# Altium schematic sheet FPGA_Power_Mannager.SchDoc
size A4
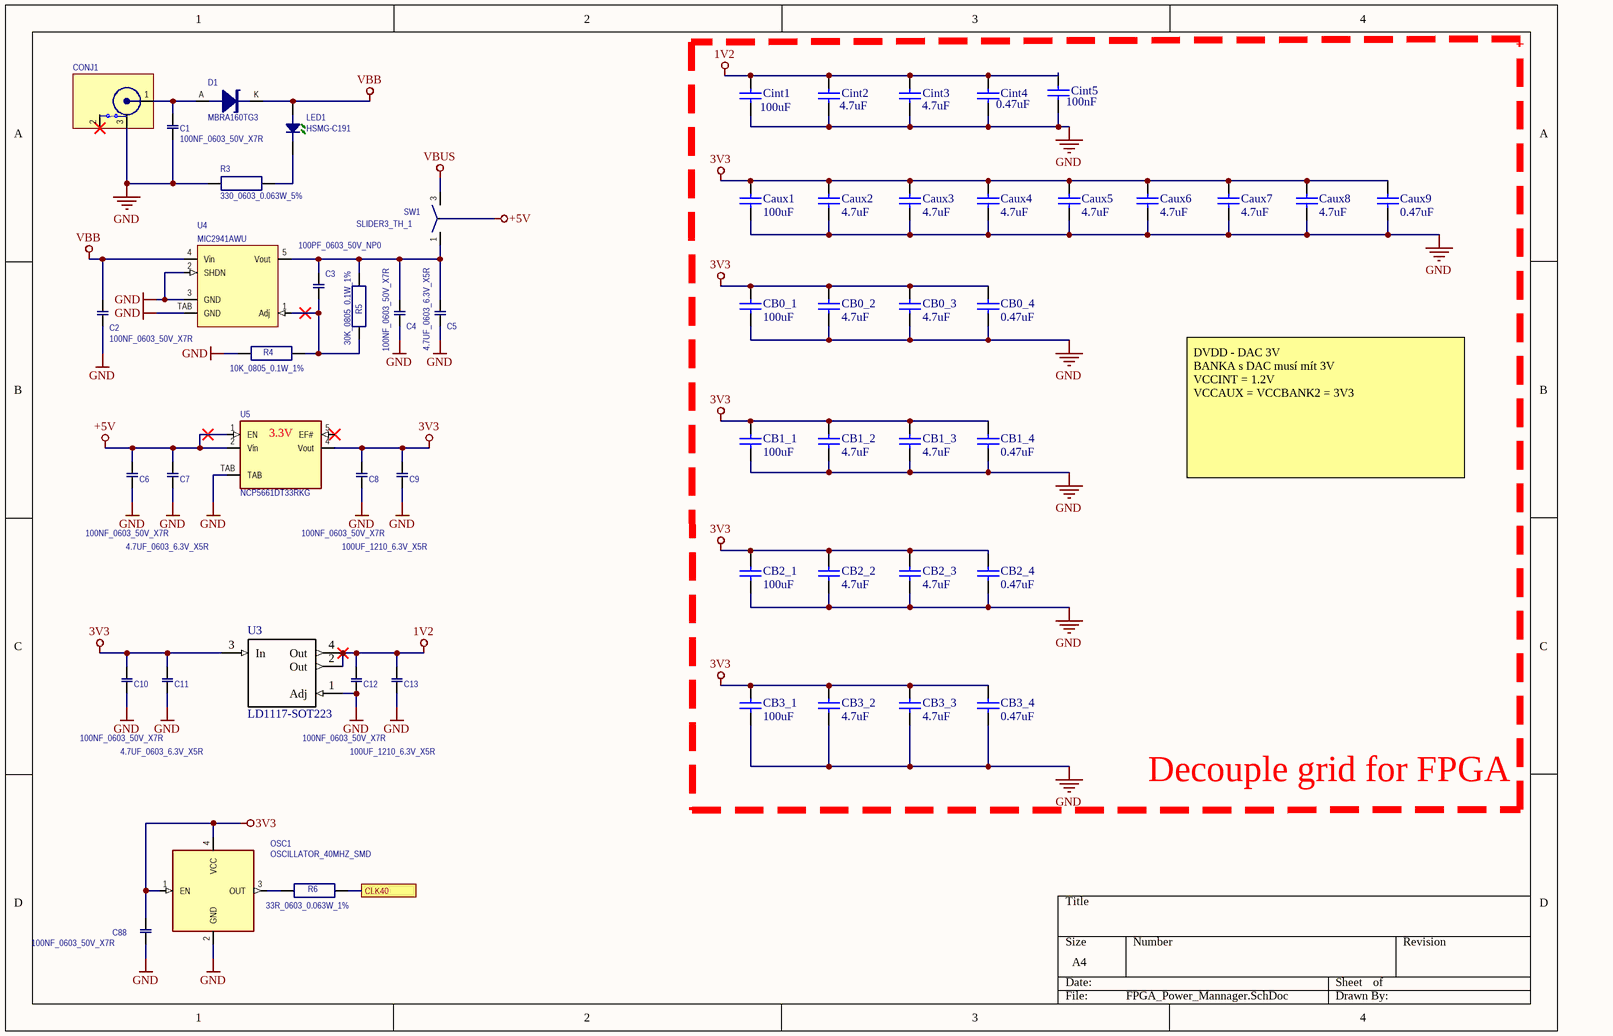
[diagram p0: FPGA_Power_Mannager.SchDoc]

## Parts
C1  100NF_0603_50V_X7R  [CAP0603]
C2  100NF_0603_50V_X7R  [CAP0603]
C3  100PF_0603_50V_NP0  [CAP0603]
C4  100NF_0603_50V_X7R  [CAP0603]
C5  4.7UF_0603_6.3V_X5R  [CAP0603]
C6  100NF_0603_50V_X7R  [CAP0603]
C7  4.7UF_0603_6.3V_X5R  [CAP0603]
C8  100NF_0603_50V_X7R  [CAP0603]
C9  100UF_1210_6.3V_X5R  [CAP1210]
C10  100NF_0603_50V_X7R  [CAP0603]
C11  4.7UF_0603_6.3V_X5R  [CAP0603]
C12  100NF_0603_50V_X7R  [CAP0603]
C13  100UF_1210_6.3V_X5R  [CAP1210]
C88  100NF_0603_50V_X7R  [CAP0603]
Caux1  100UF  [C1206]
Caux2  4.7UF  [1608[0603]]
Caux3  4.7UF  [1608[0603]]
Caux4  4.7UF  [1608[0603]]
Caux5  4.7UF  [1608[0603]]
Caux6  4.7UF  [1608[0603]]
Caux7  4.7UF  [1608[0603]]
Caux8  4.7UF  [1608[0603]]
Caux9  value 0.47uF  [1608[0603]]  (hidden comment: 470nF)
CB0_1  100UF  [C1206]
CB0_2  4.7UF  [1608[0603]]
CB0_3  4.7UF  [1608[0603]]
CB0_4  value 0.47uF  [1608[0603]]  (hidden comment: 470nF)
CB1_1  100UF  [C1206]
CB1_2  4.7UF  [1608[0603]]
CB1_3  4.7UF  [1608[0603]]
CB1_4  value 0.47uF  [1608[0603]]  (hidden comment: 470nF)
CB2_1  100UF  [C1206]
CB2_2  4.7UF  [1608[0603]]
CB2_3  4.7UF  [1608[0603]]
CB2_4  value 0.47uF  [1608[0603]]  (hidden comment: 470nF)
CB3_1  100UF  [C1206]
CB3_2  4.7UF  [1608[0603]]
CB3_3  4.7UF  [1608[0603]]
CB3_4  value 0.47uF  [1608[0603]]  (hidden comment: 470nF)
Cint1  100UF  [C1206]
Cint2  4.7UF  [1608[0603]]
Cint3  4.7UF  [1608[0603]]
Cint4  value 0.47uF  [1608[0603]]  (hidden comment: 470nF)
Cint5  100nF  [1608[0603]]
CONJ1  CON_POWER_DC10A_CLIFF  [CON_POWER_DC10A_CLIFF]  (value not drawn)
D1  MBRA160TG3  [SMA_KA]
LED1  HSMG-C191  [D0603]
OSC1  OSCILLATOR_40MHZ_SMD  [CFPS-73]
R3  330_0603_0.063W_5%  [R0603]
R4  10K_0805_0.1W_1%  [R0805]
R5  30K_0805_0.1W_1%  [R0805]
R6  33R_0603_0.063W_1%  [R0603]
SW1  SLIDER3_TH_1  [X3APH-SLIDER]
U3  LD1117-SOT223  [SOT223]
U4  MIC2941AWU  [TO263_5]
U5  NCP5661DT33RKG  [DPAK5]

## Ports
CLK40

## Nets
1V2: C12.1 C13.1 Cint1.2 Cint2.2 Cint3.2 Cint4.2 Cint5.2 U3.2(Out) U3.4(Out)
3V3: C8.1 C9.1 C10.1 C11.1 C88.2 Caux1.2 Caux2.2 Caux3.2 Caux4.2 Caux5.2 Caux6.2 Caux7.2 Caux8.2 Caux9.2 CB0_1.2 CB0_2.2 CB0_3.2 CB0_4.2 CB1_1.2 CB1_2.2 CB1_3.2 CB1_4.2 CB2_1.2 CB2_2.2 CB2_3.2 CB2_4.2 CB3_1.2 CB3_2.2 CB3_3.2 CB3_4.2 OSC1.1(EN) OSC1.4(VCC) U3.3(In) U5.4(Vout)
+5V: C6.1 C7.1 SW1.2 U5.1(EN) U5.2(Vin)
GND: C1.1 C2.1 C4.2 C5.2 C6.2 C7.2 C8.2 C9.2 C10.2 C11.2 C12.2 C13.2 C88.1 Caux1.1 Caux2.1 Caux3.1 Caux4.1 Caux5.1 Caux6.1 Caux7.1 Caux8.1 Caux9.1 CB0_1.1 CB0_2.1 CB0_3.1 CB0_4.1 CB1_1.1 CB1_2.1 CB1_3.1 CB1_4.1 CB2_1.1 CB2_2.1 CB2_3.1 CB2_4.1 CB3_1.1 CB3_2.1 CB3_3.1 CB3_4.1 Cint1.1 Cint2.1 Cint3.1 Cint4.1 Cint5.1 CONJ1.3 OSC1.2(GND) R3.1 R4.1 U3.1(Adj) U4.2(SHDN) U4.3(GND) U4.TAB(GND) U5.TAB
VBB: C2.2 D1.K(CATHODE) LED1.A U4.4(Vin)
VBUS: SW1.3
CLK40: R6.2 ; port CLK40
NetC1_2: C1.2 CONJ1.1 D1.A(ANODE)
NetC3_1: C3.1 R4.2 R5.2 U4.1(Adj)
NetC3_2: C3.2 C4.1 C5.1 R5.1 SW1.1 U4.5(Vout)
NetLED1_K: LED1.K R3.2
NetOSC1_3: OSC1.3(OUT) R6.1

Not connected (* = marked no-connect by the designer): CONJ1 2*; U5 5(EF#)*

## Notes on the sheet
- DVDD - DAC 3V
  BANKA s DAC musí mít 3V
  VCCINT = 1.2V
  VCCAUX = VCCBANK2 = 3V3
- Decouple grid for FPGA
- (in symbol NCP5661DT33RKG) 3.3V

## Library data of the parts
C1 C2 C4 C6 C8 C10 C12 C88 = 100NF_0603_50V_X7R: 128-8255    Capacitor MLC-X7R_0603_100NF_10%_50V; C0603C104K5RAC; KEMET; RoHS=Yes
C3 = 100PF_0603_50V_NP0: 141-4603    Capacitor MLC-NPO_0603_100PF_5%_50V; C0603C101J5GAC; KEMET; RoHS=Yes
C5 C7 C11 = 4.7UF_0603_6.3V_X5R: 940-2110    Capacitor MLC-X5R_0603_4.7uF_10%_6.3V; 225520613672; PHYCOMP; RoHS=Yes
C9 C13 = 100UF_1210_6.3V_X5R: 182-8817    Capacitor CML 100uF_1210_6.3V_X5R_20%; GRM32ER60J107ME20L; MURATA; RoHS=Yes
Caux1-Caux9 CB0_1-CB0_4 CB1_1-CB1_4 CB2_1-CB2_4 CB3_1-CB3_4 Cint1-Cint5 = Cap Semi: Capacitor (Semiconductor SIM Model); Published: 8-Jun-2000; LatestRevisionDate: 29-May-2009; LatestRevisionNote: IPC-7351 Footprint Added.; PackageReference: C1206; Publisher: Altium Limited; PackageDescription: Chip Capacitor
  Caux1 CB0_1 CB1_1 CB2_1 CB3_1 Cint1: Value: 100uF
  Caux2-Caux8 CB0_2 CB0_3 CB1_2 CB1_3 CB2_2 CB2_3 CB3_2 CB3_3 Cint2 Cint3: Value: 4.7uF
  Cint5: Value: 100nF
CONJ1 = CON_POWER_DC10A_CLIFF: 224-959+224-923    (PK10+PK10) SOCKET, PCB, DC POWER, 2.1MM, 5A, 12V; DC10A+DCPP1; CLIFF ELECTRONIC COMPONENTS; RoHS=Yes
D1 = MBRA160TG3: 143-1076    DIODE SCHOTTKY 60V/1A; MBRA160TG3; SMA; ONSEMI; RoHS=Yes; *: *
LED1 = HSMG-C191: 855-4617    LED DIODE GREEN 20mA, 0603; HSMG-C191; AVAGO TECHNOLOGIES; RoHS=Yes
OSC1 = OSCILLATOR_40MHZ_SMD: 522-2564US  CRYSTAL OSCILLATOR, SMD 40MHz/3.3V/50ppm; SPXO018042-CFPS-73; CFPS-73; IQD FREQUENCY PRODUCTS; RoHS=Yes
R3 = 1.0K_0603_0.063W_5%: 923-3385    RESISTOR MF_0603_1.0KR_0.063W_5%_50V; 232270260102; PHYCOMP; RoHS=Yes
R4 = 10K_0805_0.1W_1%: 933-2391    RESISTOR MF_0805_10K_0.1W_1%_100V; MC 0.1W 0805 1% 10K; MULTICOMP; RoHS=Yes (repl. for 911-975)
R5 = 30K_0805_0.1W_1%: 933-3002    RESISTOR MF_0805_30K_0.1W_1%_100V; MC 0.1W 0805 1% 30K; MULTICOMP; RoHS=Yes (repl. for 321-8235)
R6 = 33R_0603_0.063W_1%: 933-1050    RESISTOR MF_0603_33R_0.063W_1%_50V; MC_0.063W_0603_1%_33R; MULTICOMP; RoHS=Yes
SW1 = SLIDER3_TH_1: 674-345     SWITCH SLIDE SPDT VERT; 09-03290-01; EAO; RoHS=Yes
U4 = MIC2941AWU: 155-6739    VOLTAGE REGULATOR, ADJ/1,5A, MIC2941AWU; MICREL; RoHS=Yes
U5 = NCP5661DT33RKG: ONSEMI      VOLTAGE REGULATOR NCP5661DT33RKG, LINEAR, LDO, 3.3V/1A, DPAK5; ONSEMI; RoHS=Yes